# Altium project FusionVisionPCB.PrjPcb
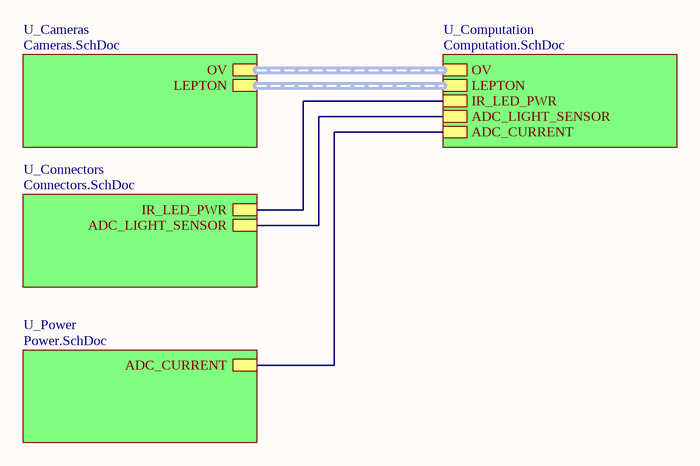
[diagram p0: CameraBoard.SchDoc]
CAGE_CODE: 1; CONTRACT_NUMBER: <CONTRACT NO>; DOC_NO_ASSY_DWG: <ASSY DWG NO>; DOC_NO_BOM: <BOM DOC NO>; DOC_NO_FAB_DWG: <FAB DWG NO>; DOC_NO_SCH_DWG: <SCH DWG NO>; PCB_2_DEC_TOL: +/-.01; PCB_3_DEC_TOL: +/-.010; PCB_ANG_TOL: +/-1/2; PCB_ASSEMBLY_NO: <PCB ASSY NO>; PCB_CHECKER: Simonas Riauka; PCB_CHECKER_APP_DATE: --/--/----; PCB_DESIGNER: Simonas Riauka; PCB_DESIGNER_APP_DATE: --/--/----; PCB_DWG_NO: <PCB DWG NO>; PCB_ENGINEER: Simonas Riauka; PCB_ENGINEER_APP_DATE: --/--/----; PCB_PART_NUMBER: <PCB PN>; PCB_REV: A; Project: FusionVision; SCH_REV: A
5 sheets, 83 parts. Net scope: hierarchical (ports join the sheet entries above them; power ports are global).
Board file: CameraBoard.PcbDoc
Sheets:
  CameraBoard.SchDoc
    U_Cameras = Cameras.SchDoc
    U_Computation = Computation.SchDoc
    U_Connectors = Connectors.SchDoc
    U_Power = Power.SchDoc

## Sheet CameraBoard.SchDoc
size A4; SheetNumber: 1; SheetTotal: 5

### Sub-sheets
U_Cameras = Cameras.SchDoc: OV (harness OV), LEPTON (harness LEPTON)
U_Computation = Computation.SchDoc: OV (harness OV), LEPTON (harness LEPTON), IR_LED_PWR, ADC_LIGHT_SENSOR, ADC_CURRENT
U_Connectors = Connectors.SchDoc: IR_LED_PWR, ADC_LIGHT_SENSOR
U_Power = Power.SchDoc: ADC_CURRENT

### Nets
NetC207_1: sheet U_Computation/ADC_CURRENT, sheet U_Power/ADC_CURRENT
NetJ100_1: sheet U_Computation/ADC_LIGHT_SENSOR, sheet U_Connectors/ADC_LIGHT_SENSOR
NetQ100_3: sheet U_Computation/IR_LED_PWR, sheet U_Connectors/IR_LED_PWR

### Buses and harness runs
harness sheet U_Cameras/LEPTON = sheet U_Computation/LEPTON
harness sheet U_Cameras/OV = sheet U_Computation/OV

## Sheet Cameras.SchDoc
size A4; SheetNumber: 4; SheetTotal: 5
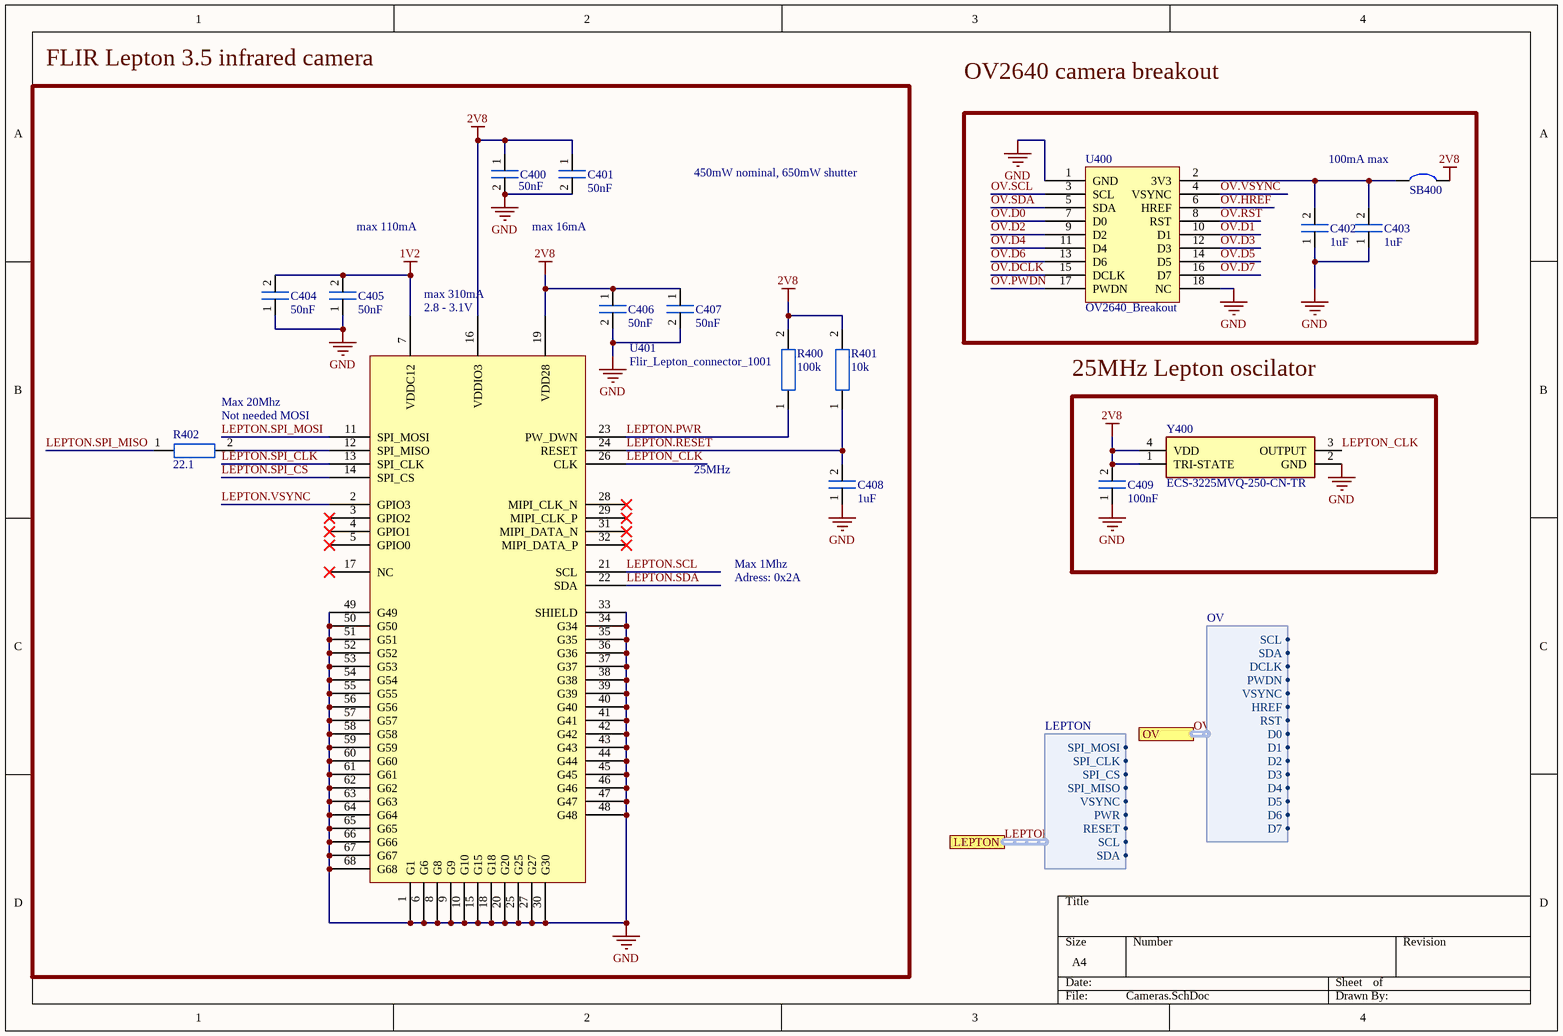
[diagram p1: Cameras.SchDoc]

### Parts
C400  50nF  [0402_footprint]
C401  50nF  [0402_footprint]
C402  1uF  [0402_footprint]
C403  1uF  [0402_footprint]
C404  50nF  [0402_footprint]
C405  50nF  [0402_footprint]
C406  50nF  [0402_footprint]
C407  50nF  [0402_footprint]
C408  1uF  [0402_footprint]
C409  100nF  [0402_footprint]
R400  100k  [0402_footprint]
R401  10k  [0402_footprint]
R402  22.1  [0402_footprint]
SB400  Solder_bridge  [SOLDER_BRIDGE]  (value not drawn)
U400  OV2640_Breakout  [OV2640_BREAKOUT]
U401  Flir_Lepton_connector_1001  [105028-1001]
Y400  ECS-3225MVQ-250-CN-TR  [ECS3225MVQ250CNTR]

### Blocks framed on the sheet
FLIR Lepton 3.5 infrared camera: C400 C401 C404-C408 R400-R402 U401
100mA max: C402 C403 SB400 U400
25MHz Lepton oscilator: C409 Y400

### Ports
LEPTON (harness LEPTON), OV (harness OV)

### Harnesses
OV: SCL, SDA, DCLK, PWDN, VSYNC, HREF, RST, D0, D1, D2, D3, D4, D5, D6, D7
LEPTON: SPI_MOSI, SPI_CLK, SPI_CS, SPI_MISO, VSYNC, PWR, RESET, SCL, SDA

### Nets
1V2: C404.2 C405.2 U401.7(VDDC12)
2V8: C400.1 C401.1 C406.1 C407.1 C409.2 R400.2 R401.2 SB400.2 U401.16(VDDIO3) U401.19(VDD28) Y400.1(TRI-STATE) Y400.4(VDD)
GND: C400.2 C401.2 C402.1 C403.1 C404.1 C405.1 C406.2 C407.2 C408.1 C409.1 U400.1(GND) U400.18(NC) U401.1(G1) U401.6(G6) U401.8(G8) U401.9(G9) U401.10(G10) U401.15(G15) U401.18(G18) U401.20(G20) U401.25(G25) U401.27(G27) U401.30(G30) U401.33(SHIELD) U401.34(G34) U401.35(G35) U401.36(G36) U401.37(G37) U401.38(G38) U401.39(G39) U401.40(G40) U401.41(G41) U401.42(G42) U401.43(G43) U401.44(G44) U401.45(G45) U401.46(G46) U401.47(G47) U401.48(G48) U401.49(G49) U401.50(G50) U401.51(G51) U401.52(G52) U401.53(G53) U401.54(G54) U401.55(G55) U401.56(G56) U401.57(G57) U401.58(G58) U401.59(G59) U401.60(G60) U401.61(G61) U401.62(G62) U401.63(G63) U401.64(G64) U401.65(G65) U401.66(G66) U401.67(G67) U401.68(G68) Y400.2(GND)
LEPTON.PWR: R400.1 U401.23(PW_DWN)
LEPTON.RESET: C408.2 R401.1 U401.24(RESET)
LEPTON.SCL: U401.21(SCL)
LEPTON.SDA: U401.22(SDA)
LEPTON.SPI_CLK: U401.13(SPI_CLK)
LEPTON.SPI_CS: U401.14(SPI_CS)
LEPTON.SPI_MISO: R402.1
LEPTON.SPI_MOSI: U401.11(SPI_MOSI)
LEPTON.VSYNC: U401.2(GPIO3)
LEPTON_CLK: U401.26(CLK) Y400.3(OUTPUT)
OV.D0: U400.7(D0)
OV.D1: U400.10(D1)
OV.D2: U400.9(D2)
OV.D3: U400.12(D3)
OV.D4: U400.11(D4)
OV.D5: U400.14(D5)
OV.D6: U400.13(D6)
OV.D7: U400.16(D7)
OV.DCLK: U400.15(DCLK)
OV.HREF: U400.6(HREF)
OV.PWDN: U400.17(PWDN)
OV.RST: U400.8(RST)
OV.SCL: U400.3(SCL)
OV.SDA: U400.5(SDA)
OV.VSYNC: U400.4(VSYNC)
NetC402_2: C402.2 C403.2 SB400.1 U400.2(3V3)
NetR402_2: R402.2 U401.12(SPI_MISO)

Not connected (* = marked no-connect by the designer): U401 3(GPIO2)* 4(GPIO1)* 5(GPIO0)* 17(NC)* 28(MIPI_CLK_N)* 29(MIPI_CLK_P)* 31(MIPI_DATA_N)* 32(MIPI_DATA_P)*

### Buses and harness runs
harness LEPTON = port LEPTON
harness OV = port OV

### Notes on the sheet
- OV2640 camera breakout
- 450mW nominal, 650mW shutter
- max 110mA
- max 16mA
- (near U401) 2.8 - 3.1V
- max 310mA
- (near R402) Not needed MOSI
- (near R402) Max 20Mhz
- 25MHz
- Max 1Mhz
- Adress: 0x2A

### Library data of the parts
C400-C409 = Capacitor_0402: 0402 capacitor
R400-R402 = Resistor_0402: 0402 resistor
U400 = OV2640_Breakout: https://www.uctronics.com/download/cam_module/OV2640DS.pdf; ComponentLink1Description: Breakout link; ComponentLink1URL: https://www.duino.lt/index.php?controller=attachment&id_attachment=447
Y400 = ECS-3225MVQ-250-CN-TR: 25MHz oscilattor; Manufacturer_Name: ECS; Datasheet Link: https://www.mouser.com/datasheet/2/122/ECS-3225MVQ-1825332.pdf; Height: 1.2mm; Manufacturer_Part_Number: ECS-3225MVQ-250-CN-TR; Mouser Part Number: 520-3225MVQ-250-CN-T; Mouser Price/Stock: https://www.mouser.co.uk/ProductDetail/ECS/ECS-3225MVQ-250-CN-TR?qs=GedFDFLaBXEiQ79b6FnYAg%3D%3D; Arrow Part Number: ECS-3225MVQ-250-CN-TR; Arrow Price/Stock: https://www.arrow.com/en/products/ecs-3225mvq-250-cn-tr/ecs-international?region=nac; ComponentLink1Description: Buy; ComponentLink1URL: https://www.mouser.lt/ProductDetail/ECS/ECS-3225MVQ-250-CN-TR?qs=GedFDFLaBXEiQ79b6FnYAg%3D%3D
U401 = Flir_Lepton_connector_1001: ComponentLink1Description: Datasheet; ComponentLink1URL: https://cdn.sparkfun.com/assets/f/6/3/4/c/Lepton_Engineering_Datasheet_Rev200.pdf; ComponentLink2Description: Buy; ComponentLink2URL: https://www.mouser.lt/ProductDetail/883-500-0771-01; ComponentLink3Description: Buy; ComponentLink3URL: https://www.mouser.lt/ProductDetail/Molex/105028-1001?qs=3OKVfsn1b5DSpyA99lGNjg%3D%3D

## Sheet Computation.SchDoc
size A4; SheetNumber: 5; SheetTotal: 5
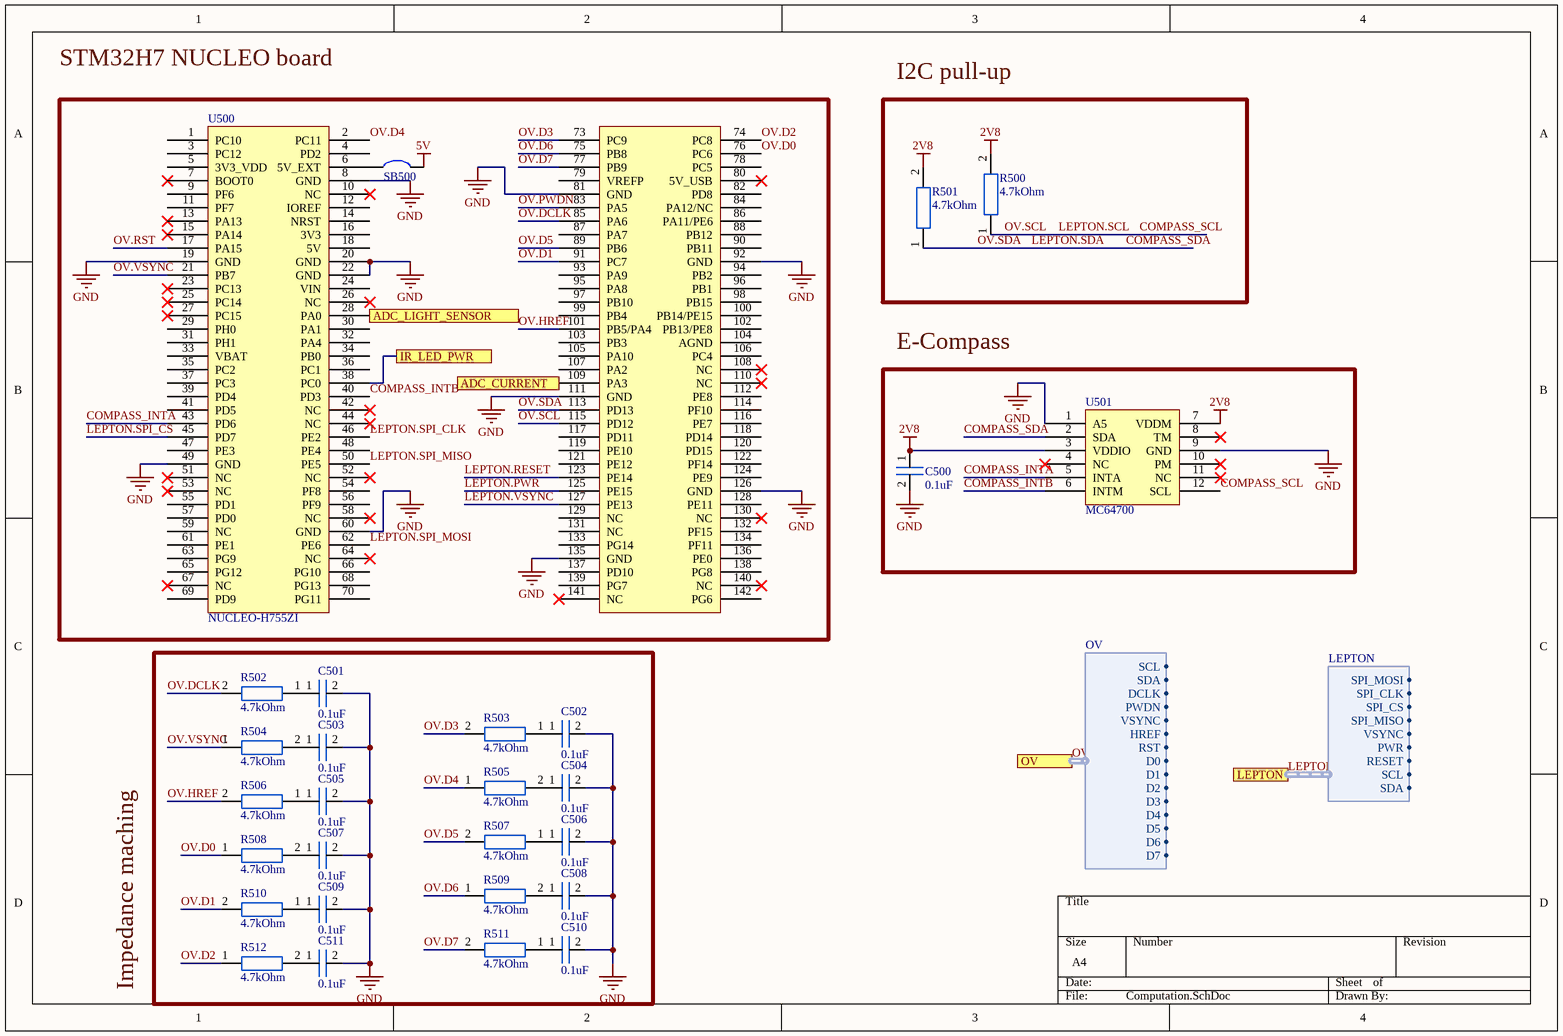
[diagram p2: Computation.SchDoc]

### Parts
C500  0.1uF  [0402_footprint]
C501  0.1uF  [0402_footprint]
C502  0.1uF  [0402_footprint]
C503  0.1uF  [0402_footprint]
C504  0.1uF  [0402_footprint]
C505  0.1uF  [0402_footprint]
C506  0.1uF  [0402_footprint]
C507  0.1uF  [0402_footprint]
C508  0.1uF  [0402_footprint]
C509  0.1uF  [0402_footprint]
C510  0.1uF  [0402_footprint]
C511  0.1uF  [0402_footprint]
R500  4.7kOhm  [0402_footprint]
R501  4.7kOhm  [0402_footprint]
R502  4.7kOhm  [0402_footprint]
R503  4.7kOhm  [0402_footprint]
R504  4.7kOhm  [0402_footprint]
R505  4.7kOhm  [0402_footprint]
R506  4.7kOhm  [0402_footprint]
R507  4.7kOhm  [0402_footprint]
R508  4.7kOhm  [0402_footprint]
R509  4.7kOhm  [0402_footprint]
R510  4.7kOhm  [0402_footprint]
R511  4.7kOhm  [0402_footprint]
R512  4.7kOhm  [0402_footprint]
SB500  Solder_bridge  [SOLDER_BRIDGE]  (value not drawn)
U500  NUCLEO-H755ZI  [H7/H5_NUCLEO_SHIELD]
U501  MC64700  [MC6470]

### Blocks framed on the sheet
I2C pull-up: R500 R501
E-Compass: C500 U501

### Ports
ADC_CURRENT, ADC_LIGHT_SENSOR, IR_LED_PWR, LEPTON (harness LEPTON), OV (harness OV)

### Harnesses
OV: SCL, SDA, DCLK, PWDN, VSYNC, HREF, RST, D0, D1, D2, D3, D4, D5, D6, D7
LEPTON: SPI_MOSI, SPI_CLK, SPI_CS, SPI_MISO, VSYNC, PWR, RESET, SCL, SDA

### Nets
2V8: C500.1 R500.2 R501.2 U501.3(VDDIO) U501.7(VDDM)
5V: SB500.2
GND: C500.2 C501.2 C502.2 C503.2 C504.2 C505.2 C506.2 C507.2 C508.2 C509.2 C510.2 C511.2 U500.8(GND) U500.19(GND) U500.20(GND) U500.22(GND) U500.49(GND) U500.60(GND) U500.81(GND) U500.92(GND) U500.111(GND) U500.126(GND) U500.135(GND) U501.1(A5) U501.9(GND)
COMPASS_INTA: U500.43(PD6) U501.5(INTA)
COMPASS_INTB: U500.40(PD3) U501.6(INTM)
COMPASS_SCL: R500.1 U500.115(PD12) U501.12(SCL)  [also labelled LEPTON.SCL, OV.SCL]
COMPASS_SDA: R501.1 U500.113(PD13) U501.2(SDA)  [also labelled LEPTON.SDA, OV.SDA]
LEPTON.PWR: U500.125(PE15)
LEPTON.RESET: U500.123(PE14)
LEPTON.SPI_CLK: U500.46(PE2)
LEPTON.SPI_CS: U500.45(PD7)
LEPTON.SPI_MISO: U500.50(PE5)
LEPTON.SPI_MOSI: U500.62(PE6)
LEPTON.VSYNC: U500.127(PE13)
OV.D0: R508.1 U500.76(PC6)
OV.D1: R510.2 U500.91(PC7)
OV.D2: R512.1 U500.74(PC8)
OV.D3: R503.2 U500.73(PC9)
OV.D4: R505.1 U500.2(PC11)
OV.D5: R507.2 U500.89(PB6)
OV.D6: R509.1 U500.75(PB8)
OV.D7: R511.2 U500.77(PB9)
OV.DCLK: R502.2 U500.85(PA6)
OV.HREF: R506.2 U500.101(PB5/PA4)
OV.PWDN: U500.83(PA5)
OV.RST: U500.17(PA15)
OV.VSYNC: R504.1 U500.21(PB7)
NetC207_1: U500.109(PA3) ; port ADC_CURRENT
NetC501_1: C501.1 R502.1
NetC502_1: C502.1 R503.1
NetC503_1: C503.1 R504.2
NetC504_1: C504.1 R505.2
NetC505_1: C505.1 R506.1
NetC506_1: C506.1 R507.1
NetC507_1: C507.1 R508.2
NetC508_1: C508.1 R509.2
NetC509_1: C509.1 R510.1
NetC510_1: C510.1 R511.1
NetC511_1: C511.1 R512.2
NetJ100_1: U500.28(PA0) ; port ADC_LIGHT_SENSOR
NetQ100_3: U500.38(PC0) ; port IR_LED_PWR
NetSB500_1: SB500.1 U500.6(5V_EXT)

Not connected (* = marked no-connect by the designer): U500 1(PC10) 3(PC12) 4(PD2) 5(3V3_VDD) 7(BOOT0)* 9(PF6) 10(NC)* 11(PF7) 12(IOREF) 13(PA13)* 14(NRST) 15(PA14)* 16(3V3) 18(5V) 23(PC13)* 24(VIN) 25(PC14)* 26(NC)* 27(PC15)* 29(PH0) 30(PA1) 31(PH1) 32(PA4) 33(VBAT) 34(PB0) 35(PC2) 36(PC1) 37(PC3) 39(PD4) 41(PD5) 42(NC)* 44(NC)* 47(PE3) 48(PE4) 51(NC)* 52(NC)* 53(NC)* 54(PF8) 55(PD1) 56(PF9) 57(PD0) 58(NC)* 59(NC) 61(PE1) 63(PG9) 64(NC)* 65(PG12) 66(PG10) 67(NC)* 68(PG13) 69(PD9) 70(PG11) 78(PC5) 79(VREFP) 80(5V_USB)* 82(PD8) 84(PA12/NC) 86(PA11/PE6) 87(PA7) 88(PB12) 90(PB11) 93(PA9) 94(PB2) 95(PA8) 96(PB1) 97(PB10) 98(PB15) 99(PB4) 100(PB14/PE15) 102(PB13/PE8) 103(PB3) 104(AGND) 105(PA10) 106(PC4) 107(PA2) 108(NC)* 110(NC)* 112(PE8) 114(PF10) 116(PE7) 117(PD11) 118(PD14) 119(PE10) 120(PD15) 121(PE12) 122(PF14) 124(PE9) 128(PE11) 129(NC) 130(NC)* 131(NC) 132(PF15) 133(PG14) 134(PF11) 136(PE0) 137(PD10) 138(PG8) 139(PG7) 140(NC)* 141(NC)* 142(PG6); U501 4(NC)* 8(TM)* 10(PM)* 11(NC)*

### Buses and harness runs
harness LEPTON = port LEPTON
harness OV = port OV

### Notes on the sheet
- STM32H7 NUCLEO board
- Impedance maching

### Library data of the parts
C500-C511 = Capacitor_0402: 0402 capacitor
R500-R512 = Resistor_0402: 0402 resistor
U500 = NUCLEO-H755ZI: https://www.st.com/en/evaluation-tools/nucleo-h755zi-q.html#documentation; ComponentLink1Description: Datasheet board; ComponentLink1URL: https://www.st.com/resource/en/user_manual/um2408-stm32h7-nucleo144-boards-mb1363-stmicroelectronics.pdf; ComponentLink2Description: Datasheet; ComponentLink2URL: https://www.google.com/url?sa=t&rct=j&q=&esrc=s&source=web&cd=&cad=rja&uact=8&ved=2ahUKEwiL2Oj0qt6BAxVAgv0HHcIABWcQFnoECAkQAQ&url=https%3A%2F%2Fwww.st.com%2Fresource%2Fen%2Fdatasheet%2Fstm32h755bi.pdf&usg=AOvVaw10mo3FsD-TXgt8LL4QIrqK&opi=89978449
U501 = MC64700: 6 axis accelerometer + magnetometer; ComponentLink1Description: Datasheet; ComponentLink1URL: https://www.mouser.lt/datasheet/2/821/MC6470_Datasheet_APS_048_0033v1_7_1-3003085.pdf

## Sheet Connectors.SchDoc
size 431 x 279 mm; SheetNumber: 2; SheetTotal: 5; ENG_APP_DATE: --/--/--; DSN_APP_DATE: --/--/--; CHK_APP_DATE: --/--/--
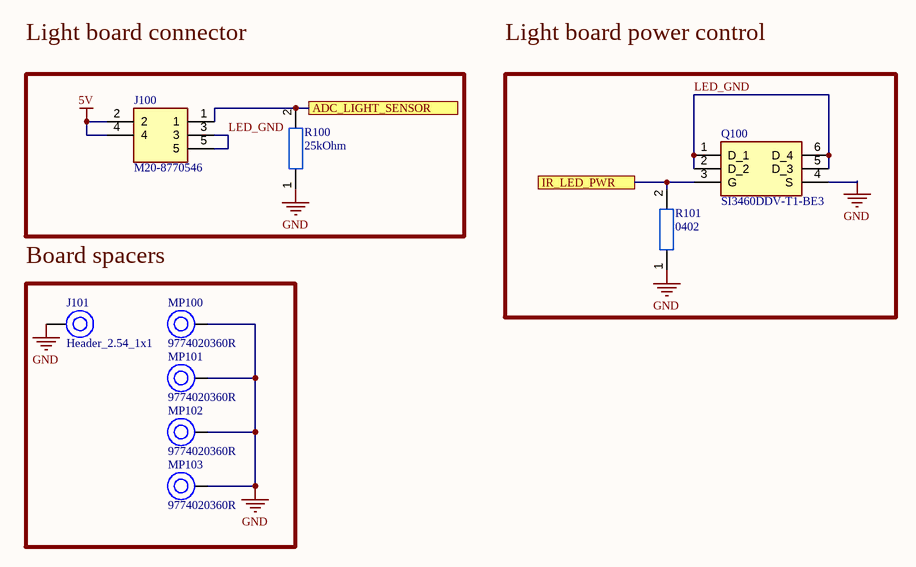
[diagram p3: Connectors.SchDoc]

### Parts
J100  M20-8770546  [M208770546]
J101  Header_2.54_1x1  [HEADER_2.54_1x1]
MP100  9774020360R  [9774020360]
MP101  9774020360R  [9774020360]
MP102  9774020360R  [9774020360]
MP103  9774020360R  [9774020360]
Q100  SI3460DDV-T1-BE3  [SOT95P284X110-6N]
R100  25kOhm  [0402_footprint]
R101  0402  [0402_footprint]

### Blocks framed on the sheet
Board spacers: J101 MP100-MP103

### Ports
ADC_LIGHT_SENSOR, IR_LED_PWR

### Nets
5V: J100.2 J100.4
GND: J101.0 MP100.1 MP101.1 MP102.1 MP103.1 Q100.4(S) R100.1 R101.1
LED_GND: J100.3 J100.5 Q100.1(D_1) Q100.2(D_2) Q100.5(D_3) Q100.6(D_4)
NetJ100_1: J100.1 R100.2 ; port ADC_LIGHT_SENSOR
NetQ100_3: Q100.3(G) R101.2 ; port IR_LED_PWR

### Notes on the sheet
- Light board connector
- Light board power control
- DWG. NO.
- REV.
- SHT.
- THIS DOCUMENT AND THE DATA DISCLOSED HEREIN OR HEREWITH IS THE PROPERTY OF ALTIUM LIMITED AND MAY BE FREELY DISTRIBUTED IN WHOLE. NO RIGHTS ARE RESERVED OR EXPRESS OR IMPLIED WARANTEE GIVEN.
- REVISION
- DESCRIPTION
- DATE
- APPROVED
- ENG:
- APPROVALS
- PROJECT
- DSN:
- CHK:
- REFERENCE DOCUMENTS
- PROJECT REVISION:
- TITLE
- DOCUMENT REVISION:
- DESIGN ITEM:
- BOM:
- FAB DWG:
- PCB DWG:
- ASSY DWG:
- SCALE:
- SIZE
- B
- CAGE CODE
- FILE NAME
- DWG NO.
- SHEET
- OF
- REV

### Library data of the parts
J100 = M20-8770546: SMD 5 pin connector; Manufacturer_Name: Harwin; Datasheet Link: https://cdn.harwin.com/pdfs/M20-877.pdf; Height: 10.01mm; Manufacturer_Part_Number: M20-8770546; Mouser Part Number: 855-M20-8770546; Mouser Price/Stock: https://www.mouser.co.uk/ProductDetail/Harwin/M20-8770546?qs=ulE8k0yEMYbi%252BxzjuY0x2Q%3D%3D; ComponentLink1Description: Buy; ComponentLink1URL: https://www.mouser.lt/ProductDetail/Amphenol-FCI/10129380-910002ALF?qs=0lQeLiL1qybuIOWgC6EkxQ%3D%3D
MP100-MP103 = CMP-208001-000010-2: SMT STEEL SPACER, M3 INTERNAL NO; NexarPartId: 75603355; Material: Steel; Min Operating Temperature: -55°C; Packaging: Tape and Reel; Length: 2mm; RoHS: Compliant; Height: 3.5mm; Max Operating Temperature: 150°C; Width: 6mm
Q100 = SI3460DDV-T1-BE3: MOSFET (N-Channel); Manufacturer_Name: Vishay; Datasheet Link: https://www.mouser.com/datasheet/2/427/SI3460DD-1764976.pdf; Height: 1.1mm; Manufacturer_Part_Number: SI3460DDV-T1-BE3; Mouser Part Number: 78-SI3460DDV-T1-BE3; Mouser Price/Stock: https://www.mouser.co.uk/ProductDetail/Vishay-Siliconix/SI3460DDV-T1-BE3?qs=CiayqK2gdcJwCX50G4xrrA%3D%3D; ComponentLink1Description: Buy; ComponentLink1URL: https://www.mouser.lt/ProductDetail/Vishay-Siliconix/SI3460DDV-T1-BE3?qs=CiayqK2gdcJwCX50G4xrrA%3D%3D
R100 R101 = Resistor_0402: 0402 resistor

## Sheet Power.SchDoc
size A4; SheetNumber: 3; SheetTotal: 5
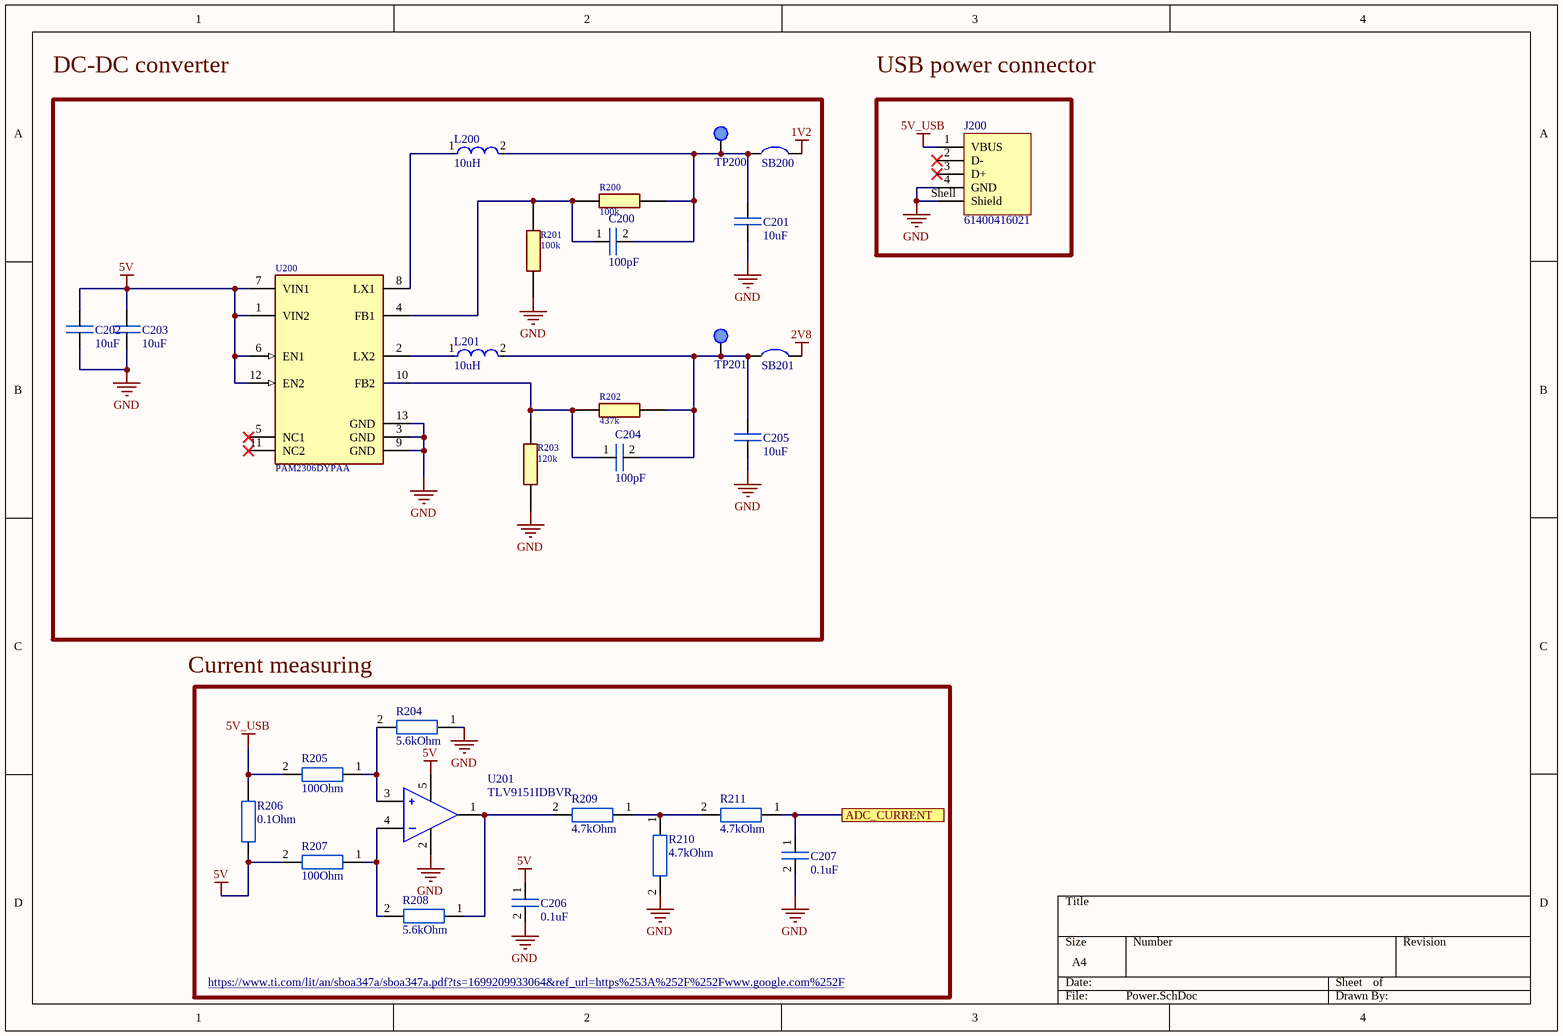
[diagram p4: Power.SchDoc]

### Parts
C200  100pF  [0402_footprint]
C201  10uF  [0805_FOOTPRINT]
C202  10uF  [0805_FOOTPRINT]
C203  10uF  [0805_FOOTPRINT]
C204  100pF  [0402_footprint]
C205  10uF  [0805_FOOTPRINT]
C206  0.1uF  [0402_footprint]
C207  0.1uF  [0402_footprint]
J200  61400416021  [61400416021]
L200  10uH  [FP-NR5040-H_4_1-MFG]
L201  10uH  [FP-NR5040-H_4_1-MFG]
R200  100k  [0805]
R201  100k  [0805]
R202  437k  [0805]
R203  120k  [0805]
R204  5.6kOhm  [0402_footprint]
R205  100Ohm  [0402_footprint]
R206  0.1Ohm  [0805_FOOTPRINT]
R207  100Ohm  [0402_footprint]
R208  5.6kOhm  [0402_footprint]
R209  4.7kOhm  [0402_footprint]
R210  4.7kOhm  [0402_footprint]
R211  4.7kOhm  [0402_footprint]
SB200  Solder_bridge  [SOLDER_BRIDGE]  (value not drawn)
SB201  Solder_bridge  [SOLDER_BRIDGE]  (value not drawn)
TP200  Test_point  [TEST_POINT]  (value not drawn)
TP201  Test_point  [TEST_POINT]  (value not drawn)
U200  PAM2306DYPAA  [DCDC]
U201  TLV9151IDBVR  [FP-DBV0005A-IPC_A]

### Ports
ADC_CURRENT

### Nets
1V2: SB200.2
2V8: SB201.2
5V: C202.2 C203.2 C206.1 R206.1 R207.2 U200.1(VIN2) U200.6(EN1) U200.7(VIN1) U200.12(EN2) U201.5(V+)
5V_USB: J200.1(VBUS) R205.2 R206.2
GND: C201.1 C202.1 C203.1 C205.1 C206.2 C207.2 J200.4(GND) J200.Shell(Shield) R201.2 R203.1 R204.1 R210.2 U200.3(GND) U200.9(GND) U200.13(GND) U201.2(V-)
NetC200_1: C200.1 R200.1 R201.1 U200.4(FB1)
NetC200_2: C200.2 C201.2 L200.2 R200.2 SB200.1 TP200.1
NetC204_1: C204.1 R202.2 R203.2 U200.10(FB2)
NetC204_2: C204.2 C205.2 L201.2 R202.1 SB201.1 TP201.1
NetC207_1: C207.1 R211.1 ; port ADC_CURRENT
NetL200_1: L200.1 U200.8(LX1)
NetL201_1: L201.1 U200.2(LX2)
NetR204_2: R204.2 R205.1 U201.3(IN+)
NetR207_1: R207.1 R208.2 U201.4(IN-)
NetR208_1: R208.1 R209.2 U201.1(OUT)
NetR209_1: R209.1 R210.1 R211.2

Not connected (* = marked no-connect by the designer): J200 2(D-)* 3(D+)*; U200 5(NC1)* 11(NC2)*

### Notes on the sheet
- DC-DC converter
- USB power connector
- (near R204) Current measuring
- https://www.ti.com/lit/an/sboa347a/sboa347a.pdf?ts=1699209933064&ref_url=https%253A%252F%252Fwww.google.com%252F

### Library data of the parts
C200 C204 C206 C207 = Capacitor_0402: 0402 capacitor
  C200 C204: ComponentLink1Description: Buy; ComponentLink1URL: https://www.mouser.lt/ProductDetail/TAIYO-YUDEN/MAASL063SB7101MFCA01?qs=tlsG%2FOw5FFiYJqKsbt67cA%3D%3D
C201-C203 C205 = Capacitor_0805: ComponentLink1Description: Buy; ComponentLink1URL: https://www.mouser.lt/ProductDetail/963-MSASL21GAB7106KT
J200 = CMP-1502-03227-2: NexarPartId: 21041530; Contact Resistance: 20mΩ; Gender: Receptacle; Voltage Rating (DC): 30V; Current Rating: 1.5A; Connector Type: USB; Insulation Resistance: 1GΩ; USB Standard: USB 2.0; Number of Contacts: 4; Number of Ports: 1; Width: 14.4mm; REACH SVHC: Unknown; Contact Plating: Gold; Length: 15.8mm; Lead Free: Lead Free; Max Operating Temperature: 105°C; Orientation: Horizontal; Contact Material: Copper; Voltage Rating: 30V; Min Operating Temperature: -40°C; Flammability Rating: UL94 V-0; Color: White; RoHS: Compliant; Number of Pins: 4; Mount: Horizontal, Through Hole; Number of Positions: 4; Operating Supply Voltage: 30V; Insulation Material: PBT; Termination: Solder; ComponentLink1Description: Buy; ComponentLink1URL: https://www.mouser.lt/ProductDetail/Amphenol-Commercial-Products/UE27AC5410H?qs=JOekRM69xWp%2FpXBIdMB8qQ%3D%3D
L200 L201 = CMP-14484-000589-1: SMD Power Inductors 10uH ±20% 2.1A 72.8mΩ
  L201: ComponentLink1Description: Buy; ComponentLink1URL: https://www.mouser.lt/ProductDetail/TAIYO-YUDEN/NRS5040T100MMGJ?qs=y6ZabgHbY%252BxiJJH9TpkLFQ%3D%3D&fbclid=IwAR06tw8zc_F3vS_tc6rGp3H4m7RLkaTrMlQiQ_PAa6jySuKYRkC0jCwxpBU
R200 = R
R201 = R: https://www.mouser.lt/ProductDetail/Panasonic/ERA-6VEB1003V?qs=rI7uf1IzohRHGRtRVKRr%2FA%3D%3D
R202 = R: RN73H2ATTD4373B25
R203 = R: ERA-6AEB124V
R204 R205 R207-R211 = Resistor_0402: 0402 resistor
R206 = Resistor_0805
U200 = PAM2306DYPAA: https://eu.mouser.com/ProductDetail/Diodes-Incorporated/PAM2306DYPAA?qs=%252BSlWJf1dfkJt9LGsP0OSAw%3D%3D&_gl=1*1y46ajh*_ga*MTcxMTg1MDAyNS4xNjk0MzU1NzEw*_ga_15W4STQT4T*MTY5ODI1ODI3MC4xNS4xLjE2OTgyNTgyNzAuNjAuMC4w; ComponentLink1Description: Datasheet; ComponentLink1URL: https://eu.mouser.com/datasheet/2/115/DIOD_S_A0010934527_1-2513103.pdf; ComponentLink2Description: Buy; ComponentLink2URL: https://www.mouser.lt/ProductDetail/Diodes-Incorporated/PAM2306DYPAA?qs=%252BSlWJf1dfkJt9LGsP0OSAw%3D%3D
U201 = CMP-04895-000336-1: OPAMP; ComponentLink1Description: Buy; ComponentLink1URL: https://www.mouser.lt/ProductDetail/Texas-Instruments/TLV9151SIDBVR?qs=bAKSY%2FctAC5JlrvQZokK1A%3D%3D; ComponentLink2Description: Datasheet; ComponentLink2URL: https://www.ti.com/lit/ds/symlink/tlv9152.pdf?HQS=dis-mous-null-mousermode-dsf-pf-null-wwe&ts=1699274671183&ref_url=https%253A%252F%252Fwww.ti.com%252Fgeneral%252Fdocs%252Fsuppproductinfo.tsp%253FdistId%253D26%2526gotoUrl%253Dhttps%253A%252F%252Fwww.ti.com%252Flit%252Fgpn%252Ftlv9152

## Nets that join several sheets
1V2: Cameras (C404.2 C405.2 U401.7), Power (SB200.2)
2V8: Cameras (12 pins), Computation (5 pins), Power (SB201.2)
5V: Computation (SB500.2), Connectors (J100.2 J100.4), Power (10 pins)
GND: Cameras (60 pins), Computation (25 pins), Connectors (8 pins), Power (16 pins)
NetC207_1: Computation (U500.109), Power (C207.1 R211.1)
NetJ100_1: Computation (U500.28), Connectors (J100.1 R100.2)
NetQ100_3: Computation (U500.38), Connectors (Q100.3 R101.2)